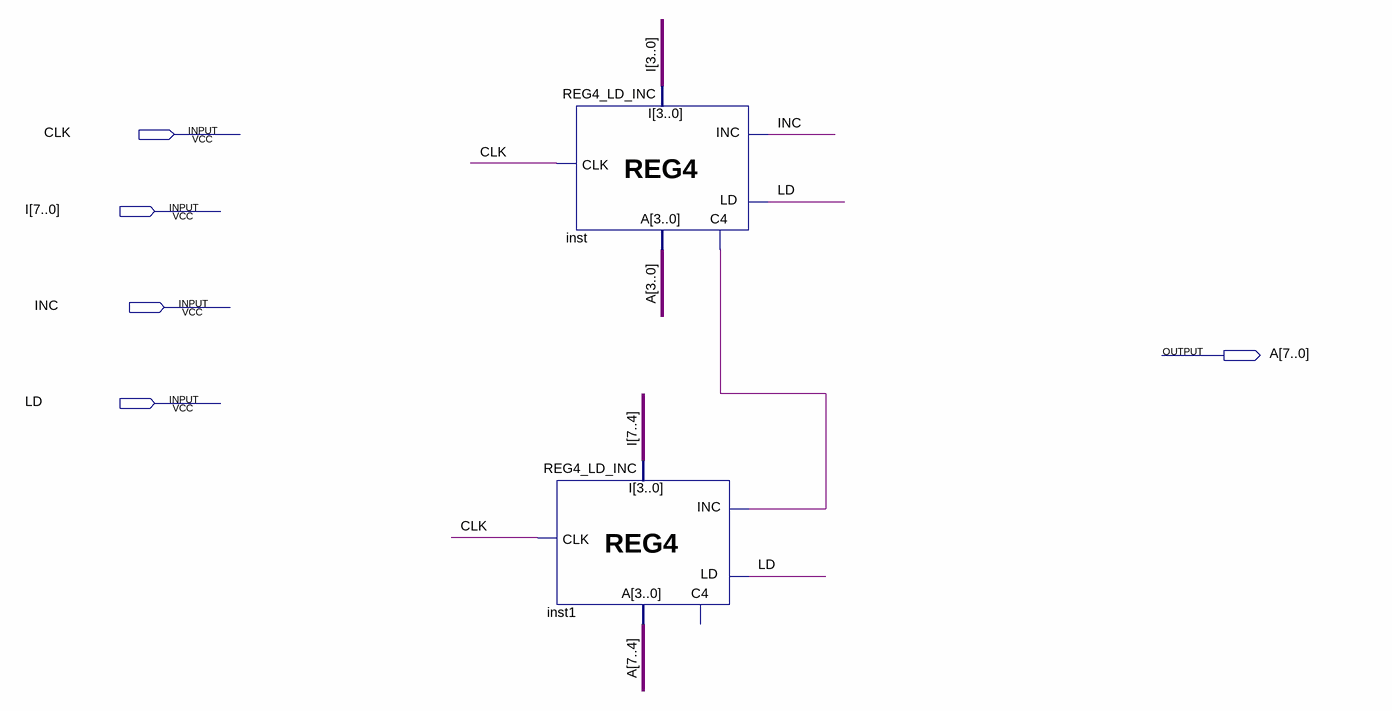
[diagram p0: schematic sheet]
// Quartus schematic REG8_LD_INC.bdf as structural Verilog: 2 symbols, 5 pins
module REG8_LD_INC (
  input  CLK,
  input  [7:0] I,
  input  INC,
  input  LD,
  output [7:0] A
);

  wire inst_c4;

  REG4_LD_INC inst (.LD(LD), .INC(INC), .CLK(CLK), .I(I[3:0]), .A(A[3:0]), .C4(inst_c4));
  REG4_LD_INC inst1 (.LD(LD), .INC(inst_c4), .CLK(CLK), .I(I[7:4]), .A(A[7:4]));  // open: C4
endmodule
